# Altium project IridiumGpsAntenna.PrjPCB
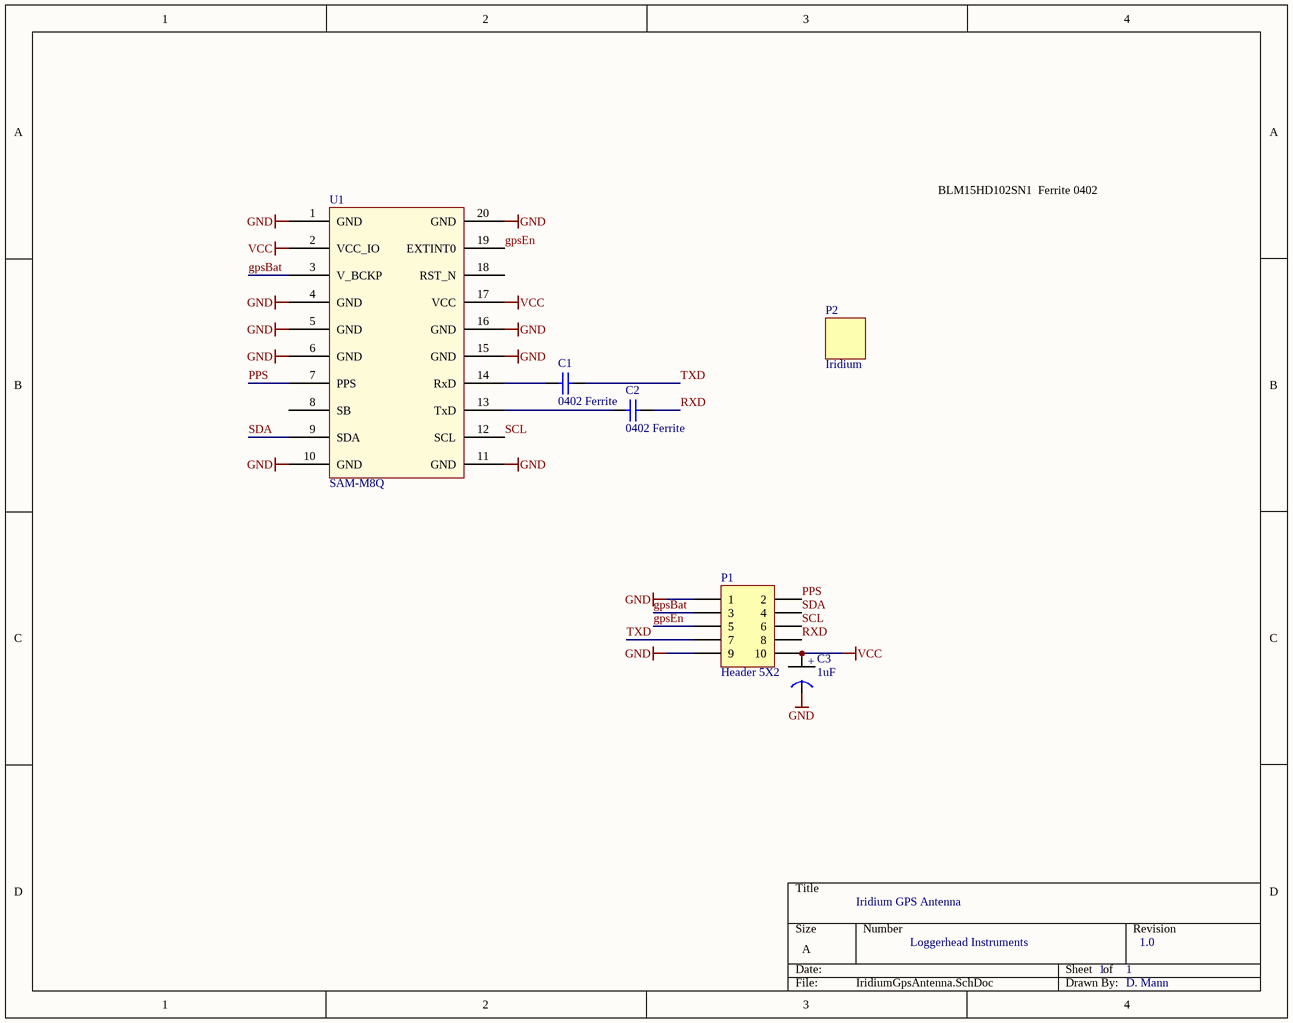
[diagram p0: IridiumGpsAntenna.SchDoc]
1 sheet, 6 parts. Net scope: global (net labels, ports and power ports of the same name join across sheets).
Board file: IridiumGpsAntenna.PcbDoc

## Sheet IridiumGpsAntenna.SchDoc
size A

### Parts
C1  0402 Ferrite  [0402]
C2  0402 Ferrite  [0402]
C3  1uF  [Tant0805]
P1  Header 5X2  [HDR2X5]
P2  Iridium  [Iridium Antenna]
U1  SAM-M8Q  [GPS SAM-MQ8]

### Nets
GND: C3.1(GND) P1.1 P1.9 U1.1(GND) U1.4(GND) U1.5(GND) U1.6(GND) U1.10(GND) U1.11(GND) U1.15(GND) U1.16(GND) U1.20(GND)
VCC: C3.2(+) P1.10 U1.2(VCC_IO) U1.17(VCC)
gpsBat: P1.3 U1.3(V_BCKP)
gpsEn: P1.5 U1.19(EXTINT0)
PPS: P1.2 U1.7(PPS)
RXD: C2.2 P1.8
SCL: P1.6 U1.12(SCL)
SDA: P1.4 U1.9(SDA)
TXD: C1.2 P1.7
NetC1_1: C1.1 U1.14(RxD)
NetC2_1: C2.1 U1.13(TxD)

Not connected (* = marked no-connect by the designer): U1 8(SB) 18(RST_N)

### Notes on the sheet
- BLM15HD102SN1  Ferrite 0402
- Iridium GPS Antenna
- Loggerhead Instruments
- 1
- 1.0
- D. Mann

### Library data of the parts
C1 C2 = C0402: Ceramic Chip Capacitor - Standard; Note: Footprint corresponds to dimensions for bulk cassette packaging. This case size has tightened tolerances.; Value: 100pF; Published: 17-Jul-2002; LatestRevisionDate: 19-Mar-2004; LatestRevisionNote: Silkscreen size reduced.; DatasheetDocument: Mar-2001; PackageDocument: Mar-2001; PackageReference: 0402; Publisher: Altium Limited; Code_JEITA: 0402; Code_IPC: 1005 [0402]; ComponentLink1Description: Manufacturer Link; ComponentLink1URL: http://www.kemet.com/; ComponentLink2Description: Datasheet; ComponentLink2URL: http://www.kemet.com/kemet/web/homepage/kechome.nsf/vapubfilesname/F3102TA.pdf/$file/F3102TA.pdf
C3 = Tant0805: Value: 1uF
P1 = Header 5X2: Header, 5-Pin, Dual row; LatestRevisionDate: 17-Jul-2002; LatestRevisionNote: Re-released for DXP Platform.; Publisher: Altium Limited
P2 = Iridium Antenna
U1 = GPS SAM-M8Q